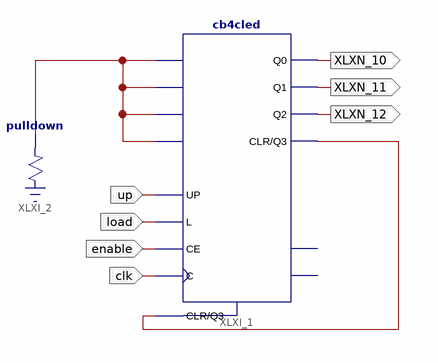
[diagram p0: schematic sheet 1]
// Xilinx ISE schematic tst1.sch (spartan6) as structural Verilog: 2 symbols, 7 ports
module tst1 (
  input  up,
  input  load,
  input  enable,
  input  clk,
  output XLXN_10,
  output XLXN_11,
  output XLXN_12
);

  wire clr, XLXN_2;

  cb4cled XLXI_1 (
    .C(clk), .CE(enable), .CLR(clr), .D0(XLXN_2), .D1(XLXN_2), .D2(XLXN_2), .D3(XLXN_2), .L(load), .UP(up),
    .Q0(XLXN_10), .Q1(XLXN_11), .Q2(XLXN_12), .Q3(clr));  // open: CEO, TC
  \pulldown  XLXI_2 (.O(XLXN_2));
endmodule
